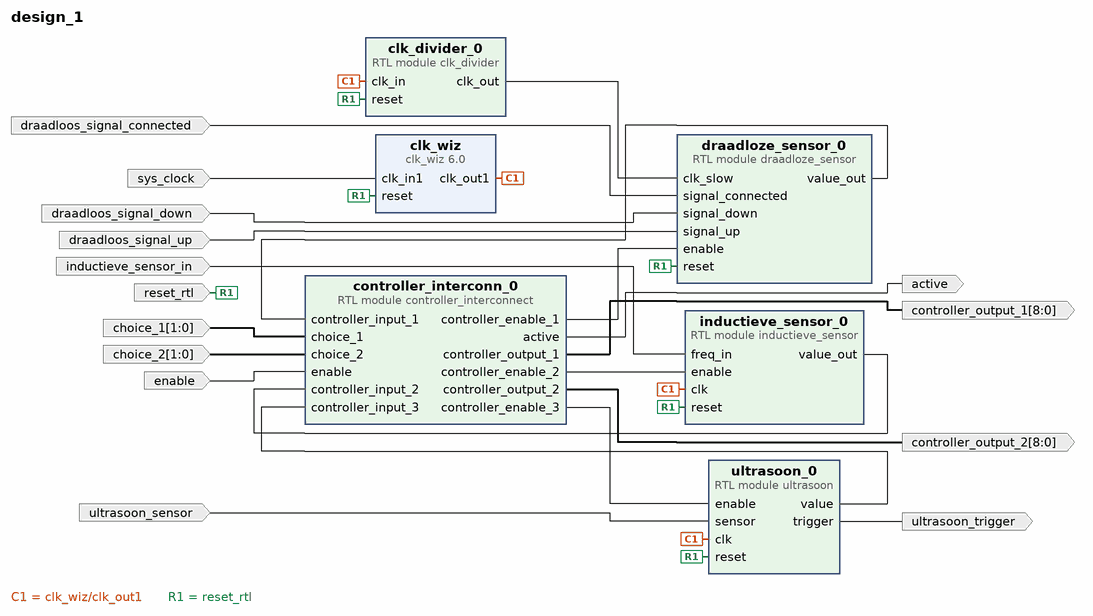
[diagram p0: block diagram of the top level]
# Vivado block design design_1, xc7z020clg400-1, Vivado 2023.1
create_bd_design design_1

create_bd_port -dir I -type clk sys_clock
set_property -dict {CONFIG.FREQ_HZ 125000000 CONFIG.PHASE 0.0} [get_bd_ports sys_clock]
create_bd_port -dir I -type rst reset_rtl
set_property -dict {CONFIG.POLARITY ACTIVE_HIGH} [get_bd_ports reset_rtl]
create_bd_port -dir I draadloos_signal_up
create_bd_port -dir I draadloos_signal_connected
create_bd_port -dir I draadloos_signal_down
create_bd_port -dir I inductieve_sensor_in
create_bd_port -dir I -from 1 -to 0 choice_1
create_bd_port -dir I -from 1 -to 0 choice_2
create_bd_port -dir I enable
create_bd_port -dir O -from 8 -to 0 controller_output_1
create_bd_port -dir O -from 8 -to 0 controller_output_2
create_bd_port -dir I ultrasoon_sensor
create_bd_port -dir O ultrasoon_trigger
create_bd_port -dir O active

create_bd_cell -type ip -vlnv xilinx.com:ip:clk_wiz:6.0 clk_wiz
set_property -dict [list \
  CONFIG.CLK_IN1_BOARD_INTERFACE sys_clock \
  CONFIG.USE_BOARD_FLOW true \
  CONFIG.USE_LOCKED false \
] [get_bd_cells clk_wiz]
create_bd_cell -type module -reference clk_divider clk_divider_0
set_property -dict {CONFIG.division 100000} [get_bd_cells clk_divider_0]
create_bd_cell -type module -reference draadloze_sensor draadloze_sensor_0
create_bd_cell -type module -reference inductieve_sensor inductieve_sensor_0
create_bd_cell -type module -reference ultrasoon ultrasoon_0
create_bd_cell -type module -reference controller_interconnect controller_interconn_0

# ---- connections ----

connect_bd_net -net choice_1_0_1 [get_bd_ports choice_1] [get_bd_pins controller_interconn_0/choice_1]
connect_bd_net -net choice_2_0_1 [get_bd_ports choice_2] [get_bd_pins controller_interconn_0/choice_2]
connect_bd_net [get_bd_pins clk_divider_0/clk_out] [get_bd_pins draadloze_sensor_0/clk_slow]
connect_bd_net [get_bd_pins clk_wiz/clk_out1] [get_bd_pins clk_divider_0/clk_in] [get_bd_pins inductieve_sensor_0/clk] [get_bd_pins ultrasoon_0/clk]
connect_bd_net [get_bd_pins controller_interconn_0/active] [get_bd_ports active]
connect_bd_net [get_bd_pins controller_interconn_0/controller_enable_1] [get_bd_pins draadloze_sensor_0/enable]
connect_bd_net [get_bd_pins controller_interconn_0/controller_enable_2] [get_bd_pins inductieve_sensor_0/enable]
connect_bd_net [get_bd_pins controller_interconn_0/controller_enable_3] [get_bd_pins ultrasoon_0/enable]
connect_bd_net [get_bd_pins controller_interconn_0/controller_output_1] [get_bd_ports controller_output_1]
connect_bd_net [get_bd_pins controller_interconn_0/controller_output_2] [get_bd_ports controller_output_2]
connect_bd_net [get_bd_pins draadloze_sensor_0/value_out] [get_bd_pins controller_interconn_0/controller_input_1]
connect_bd_net -net enable_0_1 [get_bd_ports enable] [get_bd_pins controller_interconn_0/enable]
connect_bd_net -net freq_in_0_1 [get_bd_ports inductieve_sensor_in] [get_bd_pins inductieve_sensor_0/freq_in]
connect_bd_net [get_bd_pins inductieve_sensor_0/value_out] [get_bd_pins controller_interconn_0/controller_input_2]
connect_bd_net [get_bd_ports reset_rtl] \
  [get_bd_pins clk_wiz/reset] [get_bd_pins clk_divider_0/reset] [get_bd_pins draadloze_sensor_0/reset] \
  [get_bd_pins inductieve_sensor_0/reset] [get_bd_pins ultrasoon_0/reset]
connect_bd_net -net sensor_0_1 [get_bd_ports ultrasoon_sensor] [get_bd_pins ultrasoon_0/sensor]
connect_bd_net -net signal_connected_0_1 [get_bd_ports draadloos_signal_connected] [get_bd_pins draadloze_sensor_0/signal_connected]
connect_bd_net -net signal_down_0_1 [get_bd_ports draadloos_signal_down] [get_bd_pins draadloze_sensor_0/signal_down]
connect_bd_net -net signal_up_0_1 [get_bd_ports draadloos_signal_up] [get_bd_pins draadloze_sensor_0/signal_up]
connect_bd_net [get_bd_ports sys_clock] [get_bd_pins clk_wiz/clk_in1]
connect_bd_net [get_bd_pins ultrasoon_0/trigger] [get_bd_ports ultrasoon_trigger]
connect_bd_net [get_bd_pins ultrasoon_0/value] [get_bd_pins controller_interconn_0/controller_input_3]

validate_bd_design
save_bd_design
